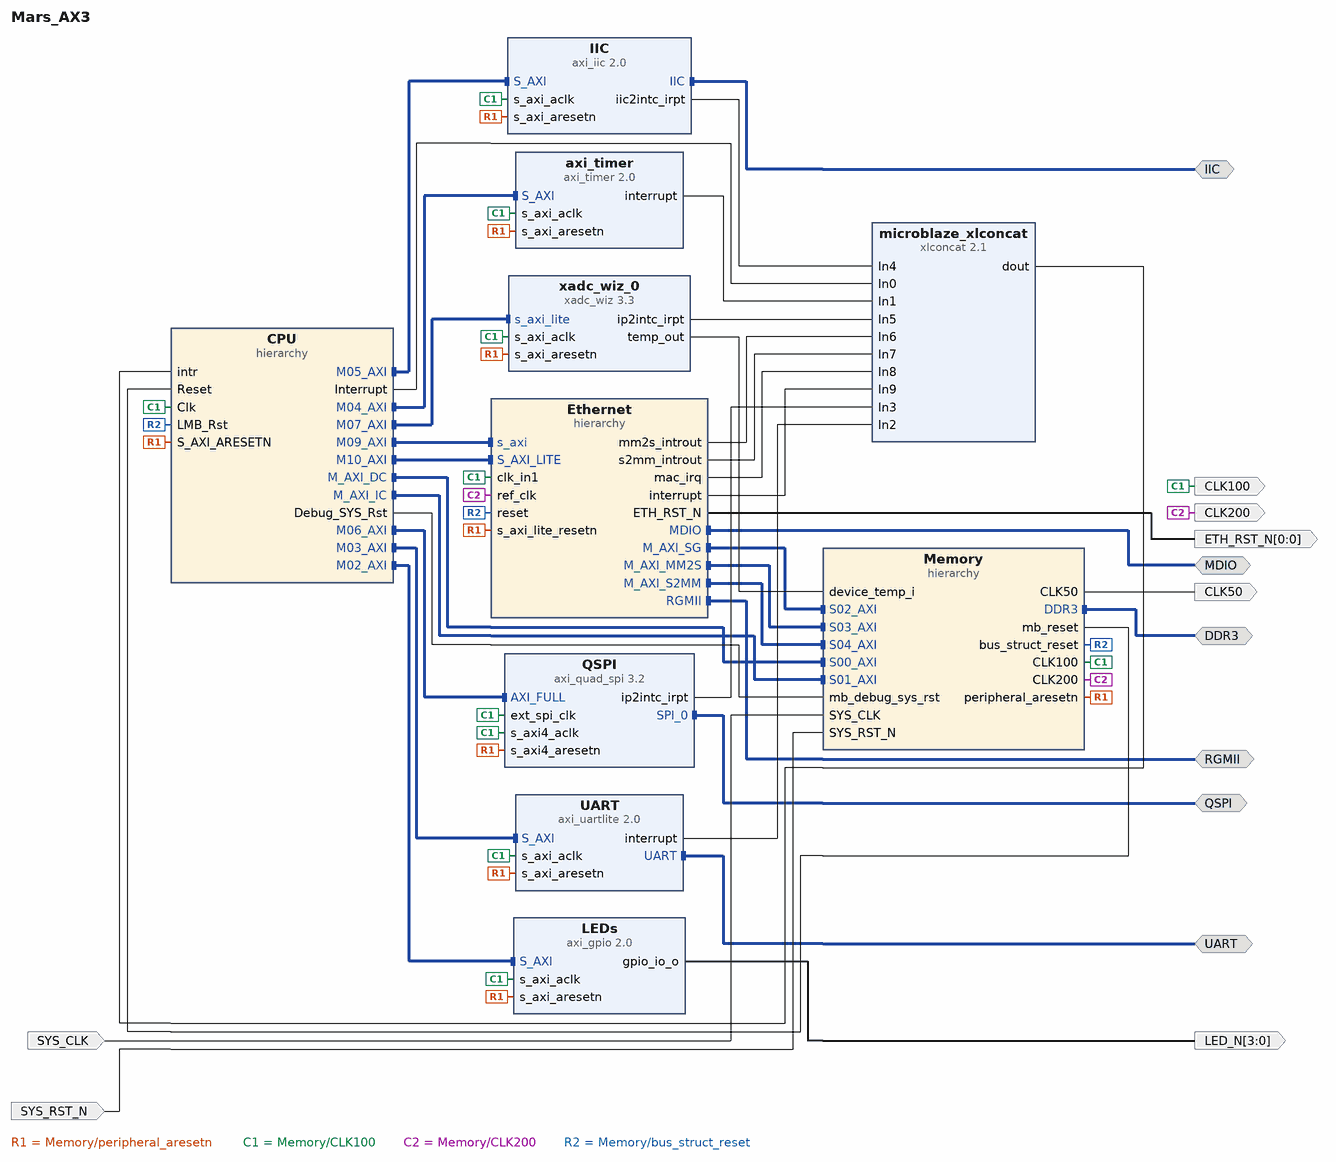
[diagram p0: block diagram of the top level]
# Vivado block design Mars_AX3, xc7a100tcsg324-2, Vivado 2020.1
create_bd_design Mars_AX3

create_bd_intf_port -mode Master -vlnv xilinx.com:interface:iic_rtl:1.0 IIC
create_bd_intf_port -mode Master -vlnv xilinx.com:interface:ddrx_rtl:1.0 DDR3
create_bd_intf_port -mode Master -vlnv xilinx.com:interface:mdio_rtl:1.0 MDIO
create_bd_intf_port -mode Master -vlnv xilinx.com:interface:rgmii_rtl:1.0 RGMII
create_bd_intf_port -mode Master -vlnv xilinx.com:interface:spi_rtl:1.0 QSPI
create_bd_intf_port -mode Master -vlnv xilinx.com:interface:uart_rtl:1.0 UART
create_bd_port -dir O -type clk CLK50
create_bd_port -dir O -type clk CLK100
create_bd_port -dir O -type clk CLK200
create_bd_port -dir I -type clk SYS_CLK
create_bd_port -dir I -type rst SYS_RST_N
create_bd_port -dir O -from 0 -to 0 -type rst ETH_RST_N
create_bd_port -dir O -from 3 -to 0 LED_N

create_bd_cell -type ip -vlnv xilinx.com:ip:axi_timer:2.0 axi_timer
create_bd_cell -type ip -vlnv xilinx.com:ip:xadc_wiz:3.3 xadc_wiz_0
set_property -dict {CONFIG.CHANNEL_ENABLE_VP_VN false CONFIG.ENABLE_TEMP_BUS true} [get_bd_cells xadc_wiz_0]
create_bd_cell -type ip -vlnv xilinx.com:ip:xlconcat:2.1 microblaze_xlconcat
set_property -dict {CONFIG.NUM_PORTS 10} [get_bd_cells microblaze_xlconcat]
create_bd_cell -type ip -vlnv xilinx.com:ip:axi_iic:2.0 IIC
create_bd_cell -type ip -vlnv xilinx.com:ip:axi_gpio:2.0 LEDs
set_property -dict {CONFIG.C_ALL_OUTPUTS 1 CONFIG.C_DOUT_DEFAULT 0x000000FF CONFIG.C_GPIO_WIDTH 4} [get_bd_cells LEDs]
create_bd_cell -type ip -vlnv xilinx.com:ip:axi_quad_spi:3.2 QSPI
set_property -dict [list \
  CONFIG.C_FIFO_DEPTH 256 \
  CONFIG.C_SPI_MEMORY 3 \
  CONFIG.C_SPI_MODE 2 \
  CONFIG.C_TYPE_OF_AXI4_INTERFACE 1 \
] [get_bd_cells QSPI]
create_bd_cell -type ip -vlnv xilinx.com:ip:axi_uartlite:2.0 UART
set_property -dict {CONFIG.C_BAUDRATE 115200} [get_bd_cells UART]
create_bd_cell -type hier CPU
create_bd_cell -type hier Memory
create_bd_cell -type hier Ethernet

# ---- hierarchy /CPU ----
current_bd_instance /CPU
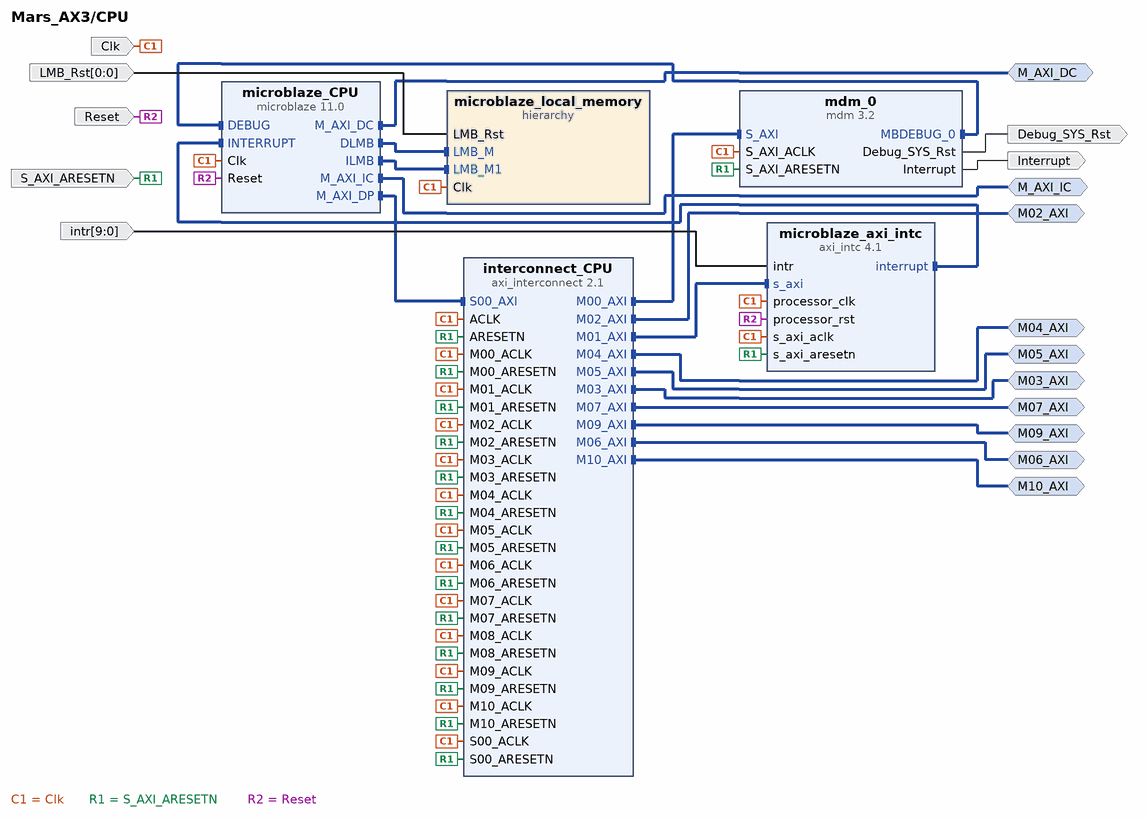
[diagram p1: block diagram inside /CPU]
create_bd_intf_pin -mode Master -vlnv xilinx.com:interface:aximm_rtl:1.0 M04_AXI
create_bd_intf_pin -mode Master -vlnv xilinx.com:interface:aximm_rtl:1.0 M07_AXI
create_bd_intf_pin -mode Master -vlnv xilinx.com:interface:aximm_rtl:1.0 M05_AXI
create_bd_intf_pin -mode Master -vlnv xilinx.com:interface:aximm_rtl:1.0 M02_AXI
create_bd_intf_pin -mode Master -vlnv xilinx.com:interface:aximm_rtl:1.0 M_AXI_DC
create_bd_intf_pin -mode Master -vlnv xilinx.com:interface:aximm_rtl:1.0 M_AXI_IC
create_bd_intf_pin -mode Master -vlnv xilinx.com:interface:aximm_rtl:1.0 M09_AXI
create_bd_intf_pin -mode Master -vlnv xilinx.com:interface:aximm_rtl:1.0 M10_AXI
create_bd_intf_pin -mode Master -vlnv xilinx.com:interface:aximm_rtl:1.0 M06_AXI
create_bd_intf_pin -mode Master -vlnv xilinx.com:interface:aximm_rtl:1.0 M03_AXI
create_bd_pin -dir I -type clk Clk
create_bd_pin -dir I -type rst S_AXI_ARESETN
create_bd_pin -dir I -from 9 -to 0 -type intr intr
create_bd_pin -dir O -type intr Interrupt
create_bd_pin -dir O -type rst Debug_SYS_Rst
create_bd_pin -dir I -from 0 -to 0 -type rst LMB_Rst
create_bd_pin -dir I -type rst Reset

create_bd_cell -type ip -vlnv xilinx.com:ip:microblaze:11.0 microblaze_CPU
set_property -dict [list \
  CONFIG.C_DCACHE_ADDR_TAG 15 \
  CONFIG.C_D_AXI 1 \
  CONFIG.C_USE_DCACHE 1 \
  CONFIG.C_USE_ICACHE 1 \
] [get_bd_cells microblaze_CPU]
create_bd_cell -type ip -vlnv xilinx.com:ip:axi_interconnect:2.1 interconnect_CPU
set_property -dict {CONFIG.NUM_MI 11 CONFIG.NUM_SI 1} [get_bd_cells interconnect_CPU]
create_bd_cell -type ip -vlnv xilinx.com:ip:mdm:3.2 mdm_0
set_property -dict {CONFIG.C_USE_UART 1} [get_bd_cells mdm_0]
create_bd_cell -type ip -vlnv xilinx.com:ip:axi_intc:4.1 microblaze_axi_intc
set_property -dict {CONFIG.C_DISABLE_SYNCHRONIZERS 1 CONFIG.C_HAS_FAST 1} [get_bd_cells microblaze_axi_intc]
create_bd_cell -type hier microblaze_local_memory

# ---- hierarchy /CPU/microblaze_local_memory ----
current_bd_instance /CPU/microblaze_local_memory
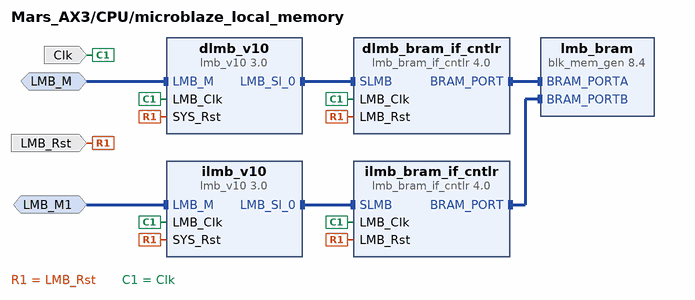
[diagram p2: block diagram inside /CPU/microblaze_local_memory]
create_bd_intf_pin -mode MirroredMaster -vlnv xilinx.com:interface:lmb_rtl:1.0 LMB_M
create_bd_intf_pin -mode MirroredMaster -vlnv xilinx.com:interface:lmb_rtl:1.0 LMB_M1
create_bd_pin -dir I -type clk Clk
create_bd_pin -dir I -type rst LMB_Rst

create_bd_cell -type ip -vlnv xilinx.com:ip:lmb_v10:3.0 dlmb_v10
create_bd_cell -type ip -vlnv xilinx.com:ip:lmb_v10:3.0 ilmb_v10
create_bd_cell -type ip -vlnv xilinx.com:ip:lmb_bram_if_cntlr:4.0 dlmb_bram_if_cntlr
create_bd_cell -type ip -vlnv xilinx.com:ip:lmb_bram_if_cntlr:4.0 ilmb_bram_if_cntlr
create_bd_cell -type ip -vlnv xilinx.com:ip:blk_mem_gen:8.4 lmb_bram
set_property -dict [list \
  CONFIG.Enable_B Use_ENB_Pin \
  CONFIG.Memory_Type True_Dual_Port_RAM \
  CONFIG.Port_B_Clock 100 \
  CONFIG.Port_B_Enable_Rate 100 \
  CONFIG.Port_B_Write_Rate 50 \
  CONFIG.Use_RSTB_Pin true \
] [get_bd_cells lmb_bram]

# ---- hierarchy /Memory ----
current_bd_instance /Memory
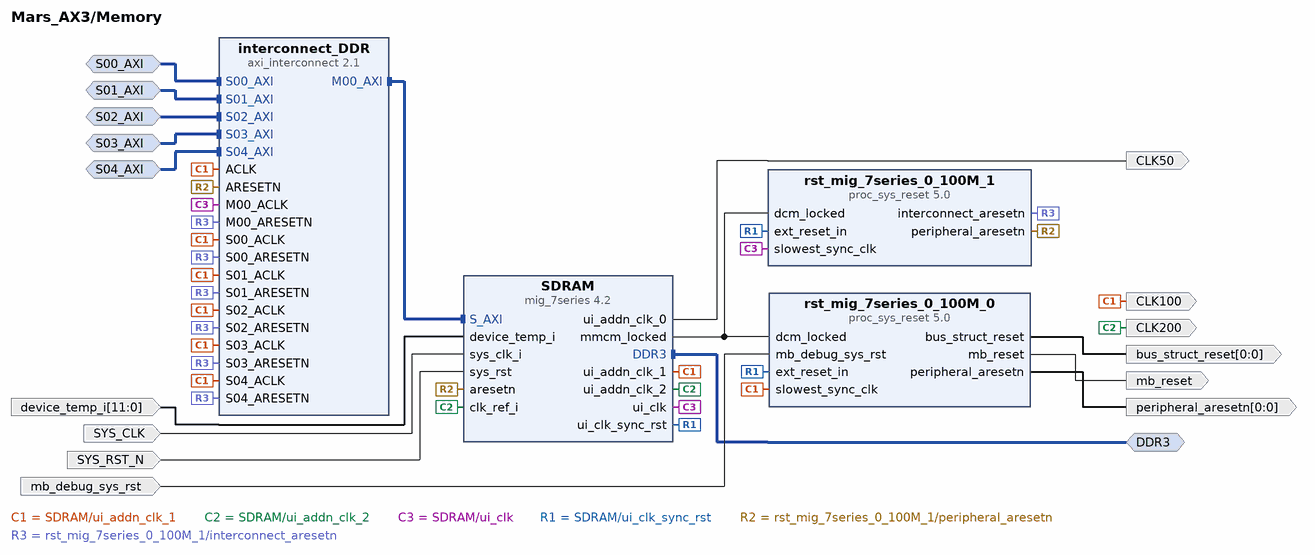
[diagram p3: block diagram inside /Memory]
create_bd_intf_pin -mode Master -vlnv xilinx.com:interface:ddrx_rtl:1.0 DDR3
create_bd_intf_pin -mode Slave -vlnv xilinx.com:interface:aximm_rtl:1.0 S00_AXI
create_bd_intf_pin -mode Slave -vlnv xilinx.com:interface:aximm_rtl:1.0 S01_AXI
create_bd_intf_pin -mode Slave -vlnv xilinx.com:interface:aximm_rtl:1.0 S02_AXI
create_bd_intf_pin -mode Slave -vlnv xilinx.com:interface:aximm_rtl:1.0 S03_AXI
create_bd_intf_pin -mode Slave -vlnv xilinx.com:interface:aximm_rtl:1.0 S04_AXI
create_bd_pin -dir O -type clk CLK50
create_bd_pin -dir O -type clk CLK100
create_bd_pin -dir O -type clk CLK200
create_bd_pin -dir I -from 11 -to 0 device_temp_i
create_bd_pin -dir I -type clk SYS_CLK
create_bd_pin -dir I -type rst SYS_RST_N
create_bd_pin -dir I -type rst mb_debug_sys_rst
create_bd_pin -dir O -from 0 -to 0 -type rst peripheral_aresetn
create_bd_pin -dir O -from 0 -to 0 -type rst bus_struct_reset
create_bd_pin -dir O -type rst mb_reset

create_bd_cell -type ip -vlnv xilinx.com:ip:mig_7series:4.2 SDRAM
set_property -dict {CONFIG.XML_INPUT_FILE mig.prj} [get_bd_cells SDRAM]
create_bd_cell -type ip -vlnv xilinx.com:ip:axi_interconnect:2.1 interconnect_DDR
set_property -dict {CONFIG.NUM_MI 1 CONFIG.NUM_SI 5} [get_bd_cells interconnect_DDR]
create_bd_cell -type ip -vlnv xilinx.com:ip:proc_sys_reset:5.0 rst_mig_7series_0_100M_0
set_property -dict {CONFIG.C_AUX_RESET_HIGH 0} [get_bd_cells rst_mig_7series_0_100M_0]
create_bd_cell -type ip -vlnv xilinx.com:ip:proc_sys_reset:5.0 rst_mig_7series_0_100M_1
set_property -dict {CONFIG.C_AUX_RESET_HIGH 0} [get_bd_cells rst_mig_7series_0_100M_1]

# ---- hierarchy /Ethernet ----
current_bd_instance /Ethernet
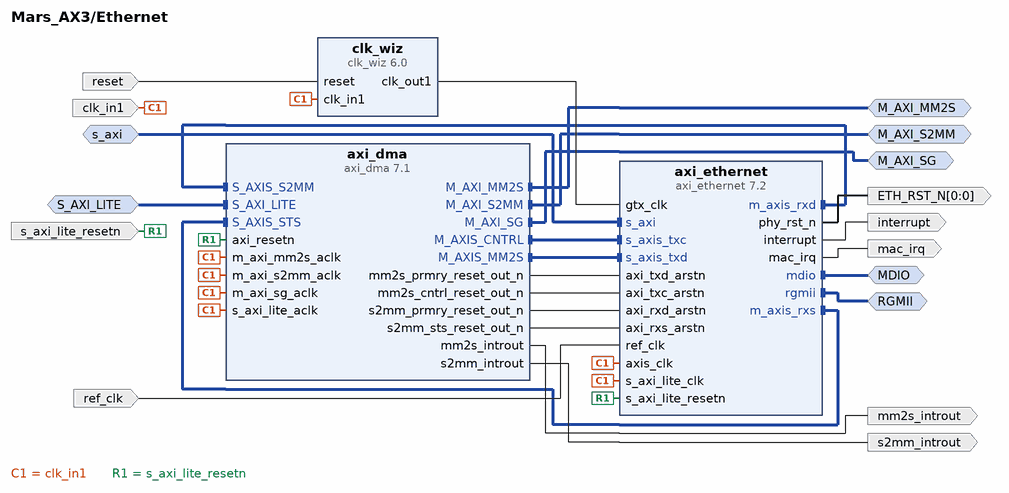
[diagram p4: block diagram inside /Ethernet]
create_bd_intf_pin -mode Slave -vlnv xilinx.com:interface:aximm_rtl:1.0 s_axi
create_bd_intf_pin -mode Master -vlnv xilinx.com:interface:mdio_rtl:1.0 MDIO
create_bd_intf_pin -mode Master -vlnv xilinx.com:interface:rgmii_rtl:1.0 RGMII
create_bd_intf_pin -mode Master -vlnv xilinx.com:interface:aximm_rtl:1.0 M_AXI_SG
create_bd_intf_pin -mode Master -vlnv xilinx.com:interface:aximm_rtl:1.0 M_AXI_MM2S
create_bd_intf_pin -mode Master -vlnv xilinx.com:interface:aximm_rtl:1.0 M_AXI_S2MM
create_bd_intf_pin -mode Slave -vlnv xilinx.com:interface:aximm_rtl:1.0 S_AXI_LITE
create_bd_pin -dir I -type clk clk_in1
create_bd_pin -dir I -type rst reset
create_bd_pin -dir I -type clk ref_clk
create_bd_pin -dir I -type rst s_axi_lite_resetn
create_bd_pin -dir O -type intr mm2s_introut
create_bd_pin -dir O -type intr s2mm_introut
create_bd_pin -dir O -from 0 -to 0 -type rst ETH_RST_N
create_bd_pin -dir O -type intr mac_irq
create_bd_pin -dir O -type intr interrupt

create_bd_cell -type ip -vlnv xilinx.com:ip:axi_ethernet:7.2 axi_ethernet
set_property -dict {CONFIG.PHY_TYPE RGMII} [get_bd_cells axi_ethernet]
create_bd_cell -type ip -vlnv xilinx.com:ip:clk_wiz:6.0 clk_wiz
set_property -dict [list \
  CONFIG.CLKOUT1_JITTER 125.247 \
  CONFIG.CLKOUT1_REQUESTED_OUT_FREQ 125.000 \
  CONFIG.MMCM_CLKOUT0_DIVIDE_F 8.000 \
  CONFIG.USE_LOCKED false \
] [get_bd_cells clk_wiz]
create_bd_cell -type ip -vlnv xilinx.com:ip:axi_dma:7.1 axi_dma
set_property -dict [list \
  CONFIG.c_include_mm2s_dre 1 \
  CONFIG.c_include_s2mm_dre 1 \
  CONFIG.c_sg_length_width 16 \
  CONFIG.c_sg_use_stsapp_length 1 \
] [get_bd_cells axi_dma]

# ---- connections ----

current_bd_instance /CPU
connect_bd_intf_net [get_bd_intf_pins microblaze_CPU/M_AXI_DP] [get_bd_intf_pins interconnect_CPU/S00_AXI]
connect_bd_intf_net [get_bd_intf_pins M_AXI_DC] [get_bd_intf_pins microblaze_CPU/M_AXI_DC]
connect_bd_intf_net [get_bd_intf_pins microblaze_CPU/DLMB] [get_bd_intf_pins microblaze_local_memory/LMB_M]
connect_bd_intf_net [get_bd_intf_pins microblaze_CPU/ILMB] [get_bd_intf_pins microblaze_local_memory/LMB_M1]
connect_bd_intf_net [get_bd_intf_pins M04_AXI] [get_bd_intf_pins interconnect_CPU/M04_AXI]
connect_bd_intf_net [get_bd_intf_pins M07_AXI] [get_bd_intf_pins interconnect_CPU/M07_AXI]
connect_bd_intf_net [get_bd_intf_pins M02_AXI] [get_bd_intf_pins interconnect_CPU/M02_AXI]
connect_bd_intf_net [get_bd_intf_pins mdm_0/MBDEBUG_0] [get_bd_intf_pins microblaze_CPU/DEBUG]
connect_bd_intf_net [get_bd_intf_pins microblaze_axi_intc/s_axi] [get_bd_intf_pins interconnect_CPU/M01_AXI]
connect_bd_intf_net [get_bd_intf_pins microblaze_axi_intc/interrupt] [get_bd_intf_pins microblaze_CPU/INTERRUPT]
connect_bd_intf_net [get_bd_intf_pins mdm_0/S_AXI] [get_bd_intf_pins interconnect_CPU/M00_AXI]
connect_bd_intf_net [get_bd_intf_pins M05_AXI] [get_bd_intf_pins interconnect_CPU/M05_AXI]
connect_bd_intf_net [get_bd_intf_pins M_AXI_IC] [get_bd_intf_pins microblaze_CPU/M_AXI_IC]
connect_bd_intf_net [get_bd_intf_pins M09_AXI] [get_bd_intf_pins interconnect_CPU/M09_AXI]
connect_bd_intf_net [get_bd_intf_pins M10_AXI] [get_bd_intf_pins interconnect_CPU/M10_AXI]
connect_bd_intf_net [get_bd_intf_pins M03_AXI] [get_bd_intf_pins interconnect_CPU/M03_AXI]
connect_bd_intf_net [get_bd_intf_pins M06_AXI] [get_bd_intf_pins interconnect_CPU/M06_AXI]
connect_bd_net [get_bd_pins Clk] \
  [get_bd_pins microblaze_CPU/Clk] [get_bd_pins interconnect_CPU/ACLK] [get_bd_pins interconnect_CPU/S00_ACLK] \
  [get_bd_pins interconnect_CPU/M00_ACLK] [get_bd_pins interconnect_CPU/M01_ACLK] [get_bd_pins interconnect_CPU/M02_ACLK] \
  [get_bd_pins interconnect_CPU/M03_ACLK] [get_bd_pins interconnect_CPU/M04_ACLK] [get_bd_pins interconnect_CPU/M05_ACLK] \
  [get_bd_pins interconnect_CPU/M06_ACLK] [get_bd_pins interconnect_CPU/M07_ACLK] [get_bd_pins interconnect_CPU/M08_ACLK] \
  [get_bd_pins interconnect_CPU/M09_ACLK] [get_bd_pins interconnect_CPU/M10_ACLK] [get_bd_pins mdm_0/S_AXI_ACLK] \
  [get_bd_pins microblaze_axi_intc/processor_clk] [get_bd_pins microblaze_axi_intc/s_axi_aclk] \
  [get_bd_pins microblaze_local_memory/Clk]
connect_bd_net [get_bd_pins S_AXI_ARESETN] \
  [get_bd_pins mdm_0/S_AXI_ARESETN] [get_bd_pins microblaze_axi_intc/s_axi_aresetn] [get_bd_pins interconnect_CPU/ARESETN] \
  [get_bd_pins interconnect_CPU/S00_ARESETN] [get_bd_pins interconnect_CPU/M00_ARESETN] \
  [get_bd_pins interconnect_CPU/M01_ARESETN] [get_bd_pins interconnect_CPU/M02_ARESETN] \
  [get_bd_pins interconnect_CPU/M03_ARESETN] [get_bd_pins interconnect_CPU/M04_ARESETN] \
  [get_bd_pins interconnect_CPU/M05_ARESETN] [get_bd_pins interconnect_CPU/M06_ARESETN] \
  [get_bd_pins interconnect_CPU/M07_ARESETN] [get_bd_pins interconnect_CPU/M08_ARESETN] \
  [get_bd_pins interconnect_CPU/M09_ARESETN] [get_bd_pins interconnect_CPU/M10_ARESETN]
connect_bd_net [get_bd_pins Reset] [get_bd_pins microblaze_axi_intc/processor_rst] [get_bd_pins microblaze_CPU/Reset]
connect_bd_net [get_bd_pins intr] [get_bd_pins microblaze_axi_intc/intr]
connect_bd_net [get_bd_pins mdm_0/Interrupt] [get_bd_pins Interrupt]
connect_bd_net [get_bd_pins mdm_0/Debug_SYS_Rst] [get_bd_pins Debug_SYS_Rst]
connect_bd_net [get_bd_pins LMB_Rst] [get_bd_pins microblaze_local_memory/LMB_Rst]
set_property HDL_ATTRIBUTE.BMM_INFO_PROCESSOR {microblaze-le > Mars_AX3 CPU/microblaze_local_memory/dlmb_bram_if_cntlr} [get_bd_cells microblaze_CPU]
set_property HDL_ATTRIBUTE.KEEP_HIERARCHY yes [get_bd_cells microblaze_CPU]

current_bd_instance /CPU/microblaze_local_memory
connect_bd_intf_net [get_bd_intf_pins dlmb_v10/LMB_Sl_0] [get_bd_intf_pins dlmb_bram_if_cntlr/SLMB]
connect_bd_intf_net [get_bd_intf_pins LMB_M] [get_bd_intf_pins dlmb_v10/LMB_M]
connect_bd_intf_net [get_bd_intf_pins dlmb_bram_if_cntlr/BRAM_PORT] [get_bd_intf_pins lmb_bram/BRAM_PORTA]
connect_bd_intf_net [get_bd_intf_pins ilmb_v10/LMB_Sl_0] [get_bd_intf_pins ilmb_bram_if_cntlr/SLMB]
connect_bd_intf_net [get_bd_intf_pins ilmb_bram_if_cntlr/BRAM_PORT] [get_bd_intf_pins lmb_bram/BRAM_PORTB]
connect_bd_intf_net [get_bd_intf_pins LMB_M1] [get_bd_intf_pins ilmb_v10/LMB_M]
connect_bd_net [get_bd_pins LMB_Rst] \
  [get_bd_pins ilmb_v10/SYS_Rst] [get_bd_pins dlmb_v10/SYS_Rst] [get_bd_pins ilmb_bram_if_cntlr/LMB_Rst] \
  [get_bd_pins dlmb_bram_if_cntlr/LMB_Rst]
connect_bd_net [get_bd_pins Clk] \
  [get_bd_pins dlmb_bram_if_cntlr/LMB_Clk] [get_bd_pins ilmb_bram_if_cntlr/LMB_Clk] [get_bd_pins dlmb_v10/LMB_Clk] \
  [get_bd_pins ilmb_v10/LMB_Clk]
set_property HDL_ATTRIBUTE.BMM_INFO_ADDRESS_SPACE {byte  0x00000000 32 > Mars_AX3 CPU/microblaze_local_memory/lmb_bram} [get_bd_cells dlmb_bram_if_cntlr]
set_property HDL_ATTRIBUTE.KEEP_HIERARCHY yes [get_bd_cells dlmb_bram_if_cntlr]

current_bd_instance /Memory
connect_bd_intf_net [get_bd_intf_pins S00_AXI] [get_bd_intf_pins interconnect_DDR/S00_AXI]
connect_bd_intf_net [get_bd_intf_pins interconnect_DDR/M00_AXI] [get_bd_intf_pins SDRAM/S_AXI]
connect_bd_intf_net [get_bd_intf_pins DDR3] [get_bd_intf_pins SDRAM/DDR3]
connect_bd_intf_net [get_bd_intf_pins S01_AXI] [get_bd_intf_pins interconnect_DDR/S01_AXI]
connect_bd_intf_net [get_bd_intf_pins S02_AXI] [get_bd_intf_pins interconnect_DDR/S02_AXI]
connect_bd_intf_net [get_bd_intf_pins S03_AXI] [get_bd_intf_pins interconnect_DDR/S03_AXI]
connect_bd_intf_net [get_bd_intf_pins S04_AXI] [get_bd_intf_pins interconnect_DDR/S04_AXI]
connect_bd_net [get_bd_pins SDRAM/ui_addn_clk_0] [get_bd_pins CLK50]
connect_bd_net [get_bd_pins SDRAM/ui_addn_clk_1] \
  [get_bd_pins CLK100] [get_bd_pins interconnect_DDR/ACLK] [get_bd_pins interconnect_DDR/S00_ACLK] \
  [get_bd_pins interconnect_DDR/S01_ACLK] [get_bd_pins interconnect_DDR/S02_ACLK] [get_bd_pins interconnect_DDR/S03_ACLK] \
  [get_bd_pins interconnect_DDR/S04_ACLK] [get_bd_pins rst_mig_7series_0_100M_0/slowest_sync_clk]
connect_bd_net [get_bd_pins SDRAM/ui_addn_clk_2] [get_bd_pins CLK200] [get_bd_pins SDRAM/clk_ref_i]
connect_bd_net [get_bd_pins SDRAM/ui_clk] [get_bd_pins interconnect_DDR/M00_ACLK] [get_bd_pins rst_mig_7series_0_100M_1/slowest_sync_clk]
connect_bd_net [get_bd_pins device_temp_i] [get_bd_pins SDRAM/device_temp_i]
connect_bd_net [get_bd_pins SYS_CLK] [get_bd_pins SDRAM/sys_clk_i]
connect_bd_net [get_bd_pins SYS_RST_N] [get_bd_pins SDRAM/sys_rst]
connect_bd_net [get_bd_pins SDRAM/ui_clk_sync_rst] \
  [get_bd_pins rst_mig_7series_0_100M_0/ext_reset_in] [get_bd_pins rst_mig_7series_0_100M_1/ext_reset_in]
connect_bd_net [get_bd_pins SDRAM/mmcm_locked] [get_bd_pins rst_mig_7series_0_100M_0/dcm_locked] [get_bd_pins rst_mig_7series_0_100M_1/dcm_locked]
connect_bd_net [get_bd_pins mb_debug_sys_rst] [get_bd_pins rst_mig_7series_0_100M_0/mb_debug_sys_rst]
connect_bd_net [get_bd_pins rst_mig_7series_0_100M_0/peripheral_aresetn] [get_bd_pins peripheral_aresetn]
connect_bd_net [get_bd_pins rst_mig_7series_0_100M_0/bus_struct_reset] [get_bd_pins bus_struct_reset]
connect_bd_net [get_bd_pins rst_mig_7series_0_100M_0/mb_reset] [get_bd_pins mb_reset]
connect_bd_net [get_bd_pins rst_mig_7series_0_100M_1/peripheral_aresetn] [get_bd_pins SDRAM/aresetn] [get_bd_pins interconnect_DDR/ARESETN]
connect_bd_net [get_bd_pins rst_mig_7series_0_100M_1/interconnect_aresetn] \
  [get_bd_pins interconnect_DDR/M00_ARESETN] [get_bd_pins interconnect_DDR/S00_ARESETN] \
  [get_bd_pins interconnect_DDR/S01_ARESETN] [get_bd_pins interconnect_DDR/S02_ARESETN] \
  [get_bd_pins interconnect_DDR/S03_ARESETN] [get_bd_pins interconnect_DDR/S04_ARESETN]

current_bd_instance /Ethernet
connect_bd_intf_net [get_bd_intf_pins axi_ethernet/m_axis_rxd] [get_bd_intf_pins axi_dma/S_AXIS_S2MM]
connect_bd_intf_net [get_bd_intf_pins s_axi] [get_bd_intf_pins axi_ethernet/s_axi]
connect_bd_intf_net [get_bd_intf_pins axi_ethernet/m_axis_rxs] [get_bd_intf_pins axi_dma/S_AXIS_STS]
connect_bd_intf_net [get_bd_intf_pins axi_ethernet/s_axis_txc] [get_bd_intf_pins axi_dma/M_AXIS_CNTRL]
connect_bd_intf_net [get_bd_intf_pins axi_ethernet/s_axis_txd] [get_bd_intf_pins axi_dma/M_AXIS_MM2S]
connect_bd_intf_net [get_bd_intf_pins M_AXI_MM2S] [get_bd_intf_pins axi_dma/M_AXI_MM2S]
connect_bd_intf_net [get_bd_intf_pins RGMII] [get_bd_intf_pins axi_ethernet/rgmii]
connect_bd_intf_net [get_bd_intf_pins M_AXI_SG] [get_bd_intf_pins axi_dma/M_AXI_SG]
connect_bd_intf_net [get_bd_intf_pins MDIO] [get_bd_intf_pins axi_ethernet/mdio]
connect_bd_intf_net [get_bd_intf_pins M_AXI_S2MM] [get_bd_intf_pins axi_dma/M_AXI_S2MM]
connect_bd_intf_net [get_bd_intf_pins S_AXI_LITE] [get_bd_intf_pins axi_dma/S_AXI_LITE]
connect_bd_net [get_bd_pins clk_wiz/clk_out1] [get_bd_pins axi_ethernet/gtx_clk]
connect_bd_net [get_bd_pins clk_in1] \
  [get_bd_pins clk_wiz/clk_in1] [get_bd_pins axi_ethernet/s_axi_lite_clk] [get_bd_pins axi_ethernet/axis_clk] \
  [get_bd_pins axi_dma/s_axi_lite_aclk] [get_bd_pins axi_dma/m_axi_sg_aclk] [get_bd_pins axi_dma/m_axi_mm2s_aclk] \
  [get_bd_pins axi_dma/m_axi_s2mm_aclk]
connect_bd_net [get_bd_pins reset] [get_bd_pins clk_wiz/reset]
connect_bd_net [get_bd_pins ref_clk] [get_bd_pins axi_ethernet/ref_clk]
connect_bd_net [get_bd_pins axi_dma/mm2s_prmry_reset_out_n] [get_bd_pins axi_ethernet/axi_txd_arstn]
connect_bd_net [get_bd_pins axi_dma/mm2s_cntrl_reset_out_n] [get_bd_pins axi_ethernet/axi_txc_arstn]
connect_bd_net [get_bd_pins axi_dma/s2mm_prmry_reset_out_n] [get_bd_pins axi_ethernet/axi_rxd_arstn]
connect_bd_net [get_bd_pins axi_dma/s2mm_sts_reset_out_n] [get_bd_pins axi_ethernet/axi_rxs_arstn]
connect_bd_net [get_bd_pins s_axi_lite_resetn] [get_bd_pins axi_ethernet/s_axi_lite_resetn] [get_bd_pins axi_dma/axi_resetn]
connect_bd_net [get_bd_pins axi_dma/mm2s_introut] [get_bd_pins mm2s_introut]
connect_bd_net [get_bd_pins axi_dma/s2mm_introut] [get_bd_pins s2mm_introut]
connect_bd_net [get_bd_pins axi_ethernet/phy_rst_n] [get_bd_pins ETH_RST_N]
connect_bd_net [get_bd_pins axi_ethernet/mac_irq] [get_bd_pins mac_irq]
connect_bd_net [get_bd_pins axi_ethernet/interrupt] [get_bd_pins interrupt]

current_bd_instance /
connect_bd_intf_net [get_bd_intf_pins CPU/M_AXI_DC] [get_bd_intf_pins Memory/S00_AXI]
connect_bd_intf_net [get_bd_intf_pins axi_timer/S_AXI] [get_bd_intf_pins CPU/M04_AXI]
connect_bd_intf_net [get_bd_intf_pins xadc_wiz_0/s_axi_lite] [get_bd_intf_pins CPU/M07_AXI]
connect_bd_intf_net [get_bd_intf_pins LEDs/S_AXI] [get_bd_intf_pins CPU/M02_AXI]
connect_bd_intf_net [get_bd_intf_ports IIC] [get_bd_intf_pins IIC/IIC]
connect_bd_intf_net [get_bd_intf_pins IIC/S_AXI] [get_bd_intf_pins CPU/M05_AXI]
connect_bd_intf_net [get_bd_intf_ports DDR3] [get_bd_intf_pins Memory/DDR3]
connect_bd_intf_net [get_bd_intf_pins Ethernet/s_axi] [get_bd_intf_pins CPU/M09_AXI]
connect_bd_intf_net [get_bd_intf_pins CPU/M_AXI_IC] [get_bd_intf_pins Memory/S01_AXI]
connect_bd_intf_net [get_bd_intf_ports MDIO] [get_bd_intf_pins Ethernet/MDIO]
connect_bd_intf_net [get_bd_intf_ports RGMII] [get_bd_intf_pins Ethernet/RGMII]
connect_bd_intf_net [get_bd_intf_pins Ethernet/M_AXI_SG] [get_bd_intf_pins Memory/S02_AXI]
connect_bd_intf_net [get_bd_intf_pins Ethernet/M_AXI_MM2S] [get_bd_intf_pins Memory/S03_AXI]
connect_bd_intf_net [get_bd_intf_pins Ethernet/M_AXI_S2MM] [get_bd_intf_pins Memory/S04_AXI]
connect_bd_intf_net [get_bd_intf_ports QSPI] [get_bd_intf_pins QSPI/SPI_0]
connect_bd_intf_net [get_bd_intf_pins Ethernet/S_AXI_LITE] [get_bd_intf_pins CPU/M10_AXI]
connect_bd_intf_net [get_bd_intf_ports UART] [get_bd_intf_pins UART/UART]
connect_bd_intf_net [get_bd_intf_pins QSPI/AXI_FULL] [get_bd_intf_pins CPU/M06_AXI]
connect_bd_intf_net [get_bd_intf_pins UART/S_AXI] [get_bd_intf_pins CPU/M03_AXI]
connect_bd_net [get_bd_pins microblaze_xlconcat/dout] [get_bd_pins CPU/intr]
connect_bd_net [get_bd_pins CPU/Interrupt] [get_bd_pins microblaze_xlconcat/In0]
connect_bd_net [get_bd_pins axi_timer/interrupt] [get_bd_pins microblaze_xlconcat/In1]
connect_bd_net [get_bd_pins UART/interrupt] [get_bd_pins microblaze_xlconcat/In2]
connect_bd_net [get_bd_pins QSPI/ip2intc_irpt] [get_bd_pins microblaze_xlconcat/In3]
connect_bd_net [get_bd_pins IIC/iic2intc_irpt] [get_bd_pins microblaze_xlconcat/In4]
connect_bd_net [get_bd_pins xadc_wiz_0/ip2intc_irpt] [get_bd_pins microblaze_xlconcat/In5]
connect_bd_net -net S_AXI_ARESETN_1 [get_bd_pins Memory/peripheral_aresetn] \
  [get_bd_pins axi_timer/s_axi_aresetn] [get_bd_pins CPU/S_AXI_ARESETN] [get_bd_pins xadc_wiz_0/s_axi_aresetn] \
  [get_bd_pins IIC/s_axi_aresetn] [get_bd_pins LEDs/s_axi_aresetn] [get_bd_pins Ethernet/s_axi_lite_resetn] \
  [get_bd_pins QSPI/s_axi4_aresetn] [get_bd_pins UART/s_axi_aresetn]
connect_bd_net [get_bd_pins Memory/CLK50] [get_bd_ports CLK50]
connect_bd_net [get_bd_pins Memory/CLK100] \
  [get_bd_ports CLK100] [get_bd_pins axi_timer/s_axi_aclk] [get_bd_pins CPU/Clk] [get_bd_pins xadc_wiz_0/s_axi_aclk] \
  [get_bd_pins IIC/s_axi_aclk] [get_bd_pins LEDs/s_axi_aclk] [get_bd_pins QSPI/ext_spi_clk] [get_bd_pins Ethernet/clk_in1] \
  [get_bd_pins QSPI/s_axi4_aclk] [get_bd_pins UART/s_axi_aclk]
connect_bd_net [get_bd_pins Memory/CLK200] [get_bd_ports CLK200] [get_bd_pins Ethernet/ref_clk]
connect_bd_net [get_bd_pins xadc_wiz_0/temp_out] [get_bd_pins Memory/device_temp_i]
connect_bd_net [get_bd_ports SYS_CLK] [get_bd_pins Memory/SYS_CLK]
connect_bd_net [get_bd_ports SYS_RST_N] [get_bd_pins Memory/SYS_RST_N]
connect_bd_net -net mb_debug_sys_rst_1 [get_bd_pins CPU/Debug_SYS_Rst] [get_bd_pins Memory/mb_debug_sys_rst]
connect_bd_net [get_bd_pins Memory/bus_struct_reset] [get_bd_pins CPU/LMB_Rst] [get_bd_pins Ethernet/reset]
connect_bd_net [get_bd_pins Memory/mb_reset] [get_bd_pins CPU/Reset]
connect_bd_net [get_bd_pins Ethernet/mm2s_introut] [get_bd_pins microblaze_xlconcat/In6]
connect_bd_net [get_bd_pins Ethernet/s2mm_introut] [get_bd_pins microblaze_xlconcat/In7]
connect_bd_net [get_bd_pins Ethernet/ETH_RST_N] [get_bd_ports ETH_RST_N]
connect_bd_net [get_bd_pins Ethernet/mac_irq] [get_bd_pins microblaze_xlconcat/In8]
connect_bd_net [get_bd_pins Ethernet/interrupt] [get_bd_pins microblaze_xlconcat/In9]
connect_bd_net [get_bd_pins LEDs/gpio_io_o] [get_bd_ports LED_N]

# ---- address map ----
assign_bd_address -offset 0x00000000 -range 8K -target_address_space [get_bd_addr_spaces CPU/microblaze_CPU/Data] [get_bd_addr_segs CPU/microblaze_local_memory/dlmb_bram_if_cntlr/SLMB/Mem]
assign_bd_address -offset 0x40000000 -range 64K -target_address_space [get_bd_addr_spaces CPU/microblaze_CPU/Data] [get_bd_addr_segs LEDs/S_AXI/Reg]
assign_bd_address -offset 0x40600000 -range 64K -target_address_space [get_bd_addr_spaces CPU/microblaze_CPU/Data] [get_bd_addr_segs UART/S_AXI/Reg]
assign_bd_address -offset 0x40800000 -range 64K -target_address_space [get_bd_addr_spaces CPU/microblaze_CPU/Data] [get_bd_addr_segs IIC/S_AXI/Reg]
assign_bd_address -offset 0x40C00000 -range 256K -target_address_space [get_bd_addr_spaces CPU/microblaze_CPU/Data] [get_bd_addr_segs Ethernet/axi_ethernet/s_axi/Reg0]
assign_bd_address -offset 0x41200000 -range 64K -target_address_space [get_bd_addr_spaces CPU/microblaze_CPU/Data] [get_bd_addr_segs CPU/microblaze_axi_intc/S_AXI/Reg]
assign_bd_address -offset 0x41400000 -range 4K -target_address_space [get_bd_addr_spaces CPU/microblaze_CPU/Data] [get_bd_addr_segs CPU/mdm_0/S_AXI/Reg]
assign_bd_address -offset 0x41C00000 -range 64K -target_address_space [get_bd_addr_spaces CPU/microblaze_CPU/Data] [get_bd_addr_segs axi_timer/S_AXI/Reg]
assign_bd_address -offset 0x41E00000 -range 64K -target_address_space [get_bd_addr_spaces CPU/microblaze_CPU/Data] [get_bd_addr_segs Ethernet/axi_dma/S_AXI_LITE/Reg]
assign_bd_address -offset 0x44A00000 -range 64K -target_address_space [get_bd_addr_spaces CPU/microblaze_CPU/Data] [get_bd_addr_segs QSPI/aximm/MEM0]
assign_bd_address -offset 0x44A10000 -range 64K -target_address_space [get_bd_addr_spaces CPU/microblaze_CPU/Data] [get_bd_addr_segs xadc_wiz_0/s_axi_lite/Reg]
assign_bd_address -offset 0x80000000 -range 256M -target_address_space [get_bd_addr_spaces CPU/microblaze_CPU/Data] [get_bd_addr_segs Memory/SDRAM/memmap/memaddr]
assign_bd_address -offset 0x00000000 -range 8K -target_address_space [get_bd_addr_spaces CPU/microblaze_CPU/Instruction] [get_bd_addr_segs CPU/microblaze_local_memory/ilmb_bram_if_cntlr/SLMB/Mem]
assign_bd_address -offset 0x80000000 -range 256M -target_address_space [get_bd_addr_spaces CPU/microblaze_CPU/Instruction] [get_bd_addr_segs Memory/SDRAM/memmap/memaddr]
assign_bd_address -offset 0x80000000 -range 256M -target_address_space [get_bd_addr_spaces Ethernet/axi_dma/Data_MM2S] [get_bd_addr_segs Memory/SDRAM/memmap/memaddr]
assign_bd_address -offset 0x80000000 -range 256M -target_address_space [get_bd_addr_spaces Ethernet/axi_dma/Data_S2MM] [get_bd_addr_segs Memory/SDRAM/memmap/memaddr]
assign_bd_address -offset 0x80000000 -range 256M -target_address_space [get_bd_addr_spaces Ethernet/axi_dma/Data_SG] [get_bd_addr_segs Memory/SDRAM/memmap/memaddr]

validate_bd_design
save_bd_design
